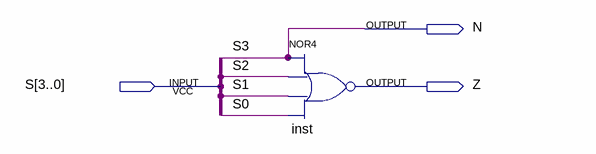
[diagram p0: schematic sheet]
// Quartus schematic FLAGS_Z-N.bdf as structural Verilog: 1 symbols, 3 pins
module \FLAGS_Z-N  (
  input  [3:0] S,
  output N,
  output Z
);

  nor inst (Z, S[3], S[2], S[1], S[0]);

  assign N = S[3];
endmodule
